# EAGLE design Display BBM (EAGLE 9.6.2)
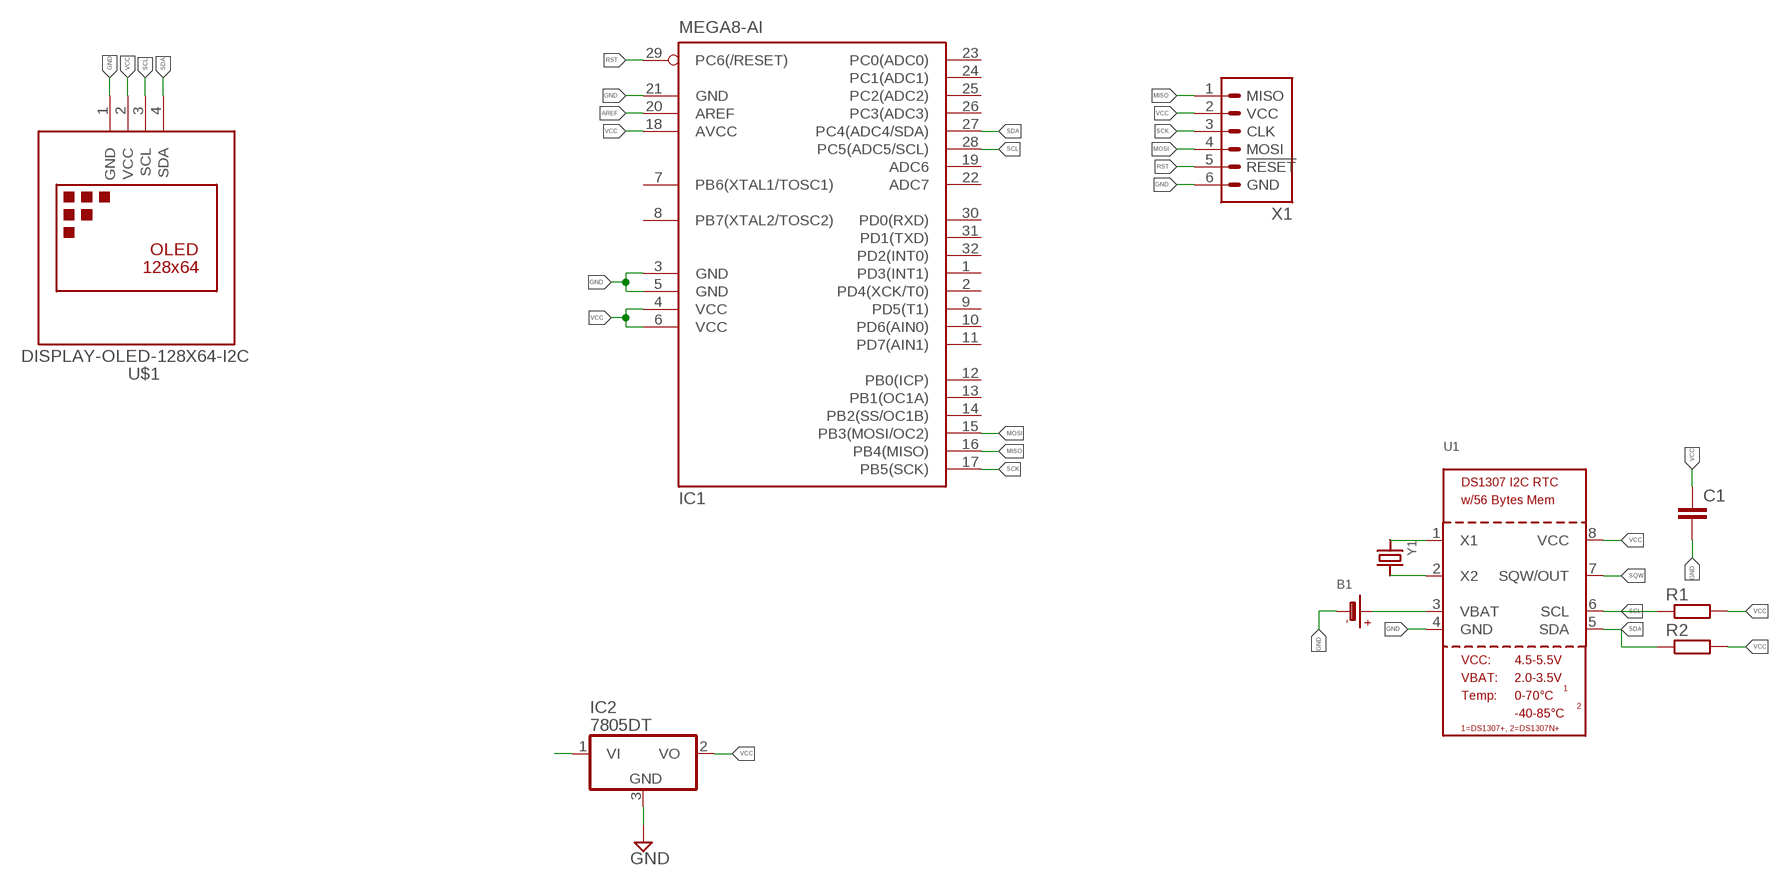
[diagram p0: schematic, sheet 1]

## Parts
B1  BATTERYCR1220_SMT  [CR1220]
C1  C-EUC0603K  [C0603K]
IC1  MEGA8-AI  [TQFP32-08]
IC2  7805DT  [TO252]
R1  R-EU_R0603  [R0603]
R2  R-EU_R0603  [R0603]
U1  RTC_DS1307  [SOIC8_150MIL]
U$1  DISPLAY-OLED-128X64-I2C  [DISPLAY-OLED-128X64-I2C]
X1  MISO_MOSIIDC-06V  [IDC-06V]
Y1  CRYSTAL8.0X3.8  [CRYSTAL_8X3.8]

## Nets
AREF: IC1.20(AREF)
GND: B1.- C1.2 IC1.3(GND) IC1.5(GND) IC1.21(GND) IC2.3(GND) U1.4(GND) U$1.1(GND) X1.6(GND)
MISO: IC1.16(PB4(MISO)) X1.1(MISO)
MOSI: IC1.15(PB3(MOSI/OC2)) X1.4(MOSI)
N$1: IC2.1(VI)
N$2: U1.1(X1) Y1.P$1
N$3: U1.2(X2) Y1.P$4
RST: IC1.29(PC6(/RESET)) X1.5(!RESET)
SCK: IC1.17(PB5(SCK)) X1.3(CLK)
SCL: IC1.28(PC5(ADC5/SCL)) R1.1 U1.6(SCL) U$1.3(SCL)
SDA: IC1.27(PC4(ADC4/SDA)) R2.1 U1.5(SDA) U$1.4(SDA)
SQW: U1.7(SQW/OUT)
VBATT: B1.+$1(+) U1.3(VBAT)
VCC: C1.1 IC1.4(VCC) IC1.6(VCC) IC1.18(AVCC) IC2.2(VO) R1.2 R2.2 U1.8(VCC) U$1.2(VCC) X1.2(VCC)
Unconnected: IC1.1(PD3(INT1)) IC1.2(PD4(XCK/T0)) IC1.7(PB6(XTAL1/TOSC1)) IC1.8(PB7(XTAL2/TOSC2)) IC1.9(PD5(T1)) IC1.10(PD6(AIN0)) IC1.11(PD7(AIN1)) IC1.12(PB0(ICP)) IC1.13(PB1(OC1A)) IC1.14(PB2(SS/OC1B)) IC1.19(ADC6) IC1.22(ADC7) IC1.23(PC0(ADC0)) IC1.24(PC1(ADC1)) IC1.25(PC2(ADC2)) IC1.26(PC3(ADC3)) IC1.30(PD0(RXD)) IC1.31(PD1(TXD)) IC1.32(PD2(INT0))

## Library data of the parts
B1 = RTC_Lib:BATTERY: CR1220 SMT - Digikey: 3001K-ND CD2032 BAT-HLD-001 - Digikey: BAT-HLD-001-ND
C1 = rcl:C-EU: CAPACITOR, European symbol; SPICEPREFIX: C
IC1 = atmel:MEGA8: MICROCONTROLLER 8 Kbytes FLASH, 1 kbytes SRAM, 512 bytes EEPROM, USART, 6-channel 10 bit ADC, 2-channel 8 bit ADC Pin compatible with Atmega48, ATMega88, ATMega168 Source: avr.lbr; MPN: ATMEGA8-16AU; OC_FARNELL: 9171371; OC_NEWARK: 73M8863
IC2 = linear:78*: Positive VOLTAGE REGULATOR Source: http://cache.national.com/ds/LM/LM78L05.pdf http://www.fairchildsemi.com/ds/LM/LM7805.pdf
R1 R2 = rcl:R-EU_: RESISTOR, European symbol; SPICEPREFIX: R
U1 = RTC_Lib:RTC_DS1307: DS1307 I2C RTC with 56-Bytes RAM
U$1 = diy-modules:DISPLAY-OLED-128X64-I2C: 128x64 Dot Matrix OLED Module based on SSD1306 chip Variant with I2C interface More details available here: http://www.instructables.com/id/Monochrome-096-i2c-OLED-display-with-arduino-SSD13/ SSD1306 datasheet: https://cdn-shop.adafruit.com/datasheets/SSD1306.pdf Click here to find device on ebay.com <http://www.ebay.com/sch/oled+display+128x64+iic> Note: There are two variants: I2C and SPI. Search for the proper version.
X1 = atmel:MISO_MOSI: MISO/MOSI Programmer Interface refere to Atmel/Microchip description of pin header style <http://microchipdeveloper.com/atmelice:connecting-atmel-ice-to-a-debugwire-target>
Y1 = RTC_Lib:CRYSTAL: Crystals HC49UP - Surface Mount Crystal 4.0MHz 18pF +/-30ppm Surface Mount Crystal [Digikey: 535-9857-1-ND] 12.0 MHz Surface Mount Crystal [Digikey: 535-9869-6-ND] 25.0 MHz Surface Mount Crystal [Digikey: 535-9078-1-ND] 2.5 x 2.0mm - MEMs SMT Crystal 16.0 MHz 10pF 20ppm 2.5 x 2.0mm Crystal [Digikey -40-85°C: 535-10923-1-ND] 3.2 x 2.5mm - MEMs SMT Crystal 12.0 MHz 8pF 15ppm 3.2 x 2.5mm Crystal [Digikey: -10-70°C: 644-1047-1-ND -40-125°C: 644-1128-1-ND] 40~85°C cheaper: 644-1173-6-ND 16.0 MHz 8pF 15ppm 3.2 x 2.5mm Crystal [Digikey: -10-70°C: 644-1049-1-ND -40-125°C: 644-1129-2-ND]-40~85°C cheaper: 644-1175-6-ND 16.0 MHz 10pF 10ppm 3.2 x 2.5mm Crystal [Digikey: 644-1100-1-ND] 27.12 MHz 18pF 30ppm 3.2 x 2.5mm Crystal [Digikey: 887-1424-1-ND] 27.12MHz 10pF 10ppm 3.2 x 2.5mm Crystal [Digikey: 887-1329-1-ND] 4.9 x 1.8mm - MEMs SMT Crystal 32.768 KHz 12.5pF 20ppm 4.9 x 1.8mm Crystal [Digikey: SE2415CT-ND] 8.0 x 3.8mm - Surface Mount Crystal 32.768kHz 12.5pF 20ppm -40°C-85°C [Digikey: 535-9166-2-ND] Cylinder 32.768KHz Cylinder Crystal (2x6mm body) [Ex. Digikey: 300-8341-2-ND]

## Board
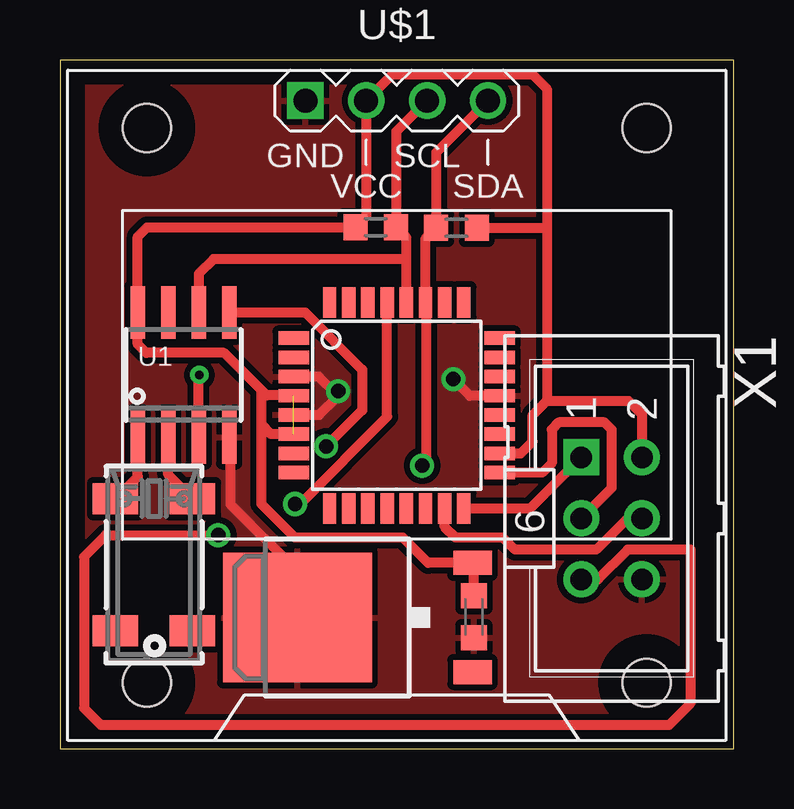
[diagram p1: board, top side]
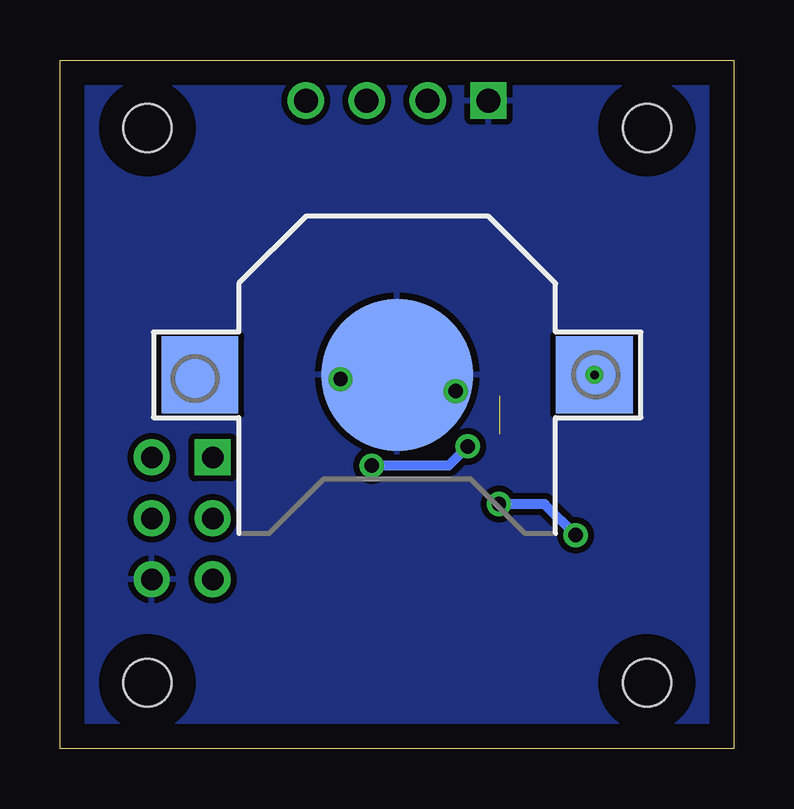
[diagram p2: board, bottom side, seen from below]

Size 28.1 x 28.7 mm. Coordinates in mm from the lower left corner, seen from the top.
Outline: 0,0 28.1,0 28.1,28.7 0,28.7 0,0
Copper layers (1*16): Top 0.035mm / dielectric 1.5mm / Bottom 0.035mm
Design rules "default": minimum track width 6mil, minimum drill 0.35mm, track to track 6mil, track to pad 6mil, pad to pad 6mil, via to via 6mil, smd to smd 6mil, copper to edge 40mil, drill to drill 6mil, minimum pad ring 10mil, minimum via ring 8mil, stop-mask expansion 4mil, vias tented up to drill 0mil, thermal gap 10mil

### Footprints (pad centres in the part's own frame; a part is rotated, then mirrored left to right if it is on the bottom)
CR1220 = smd 3.2 x 3.2: +$1 -8.225,0; +$2 8.225,0 | smd 6.35 x 6.35: - 0,0
C0603K = smd 1.05 x 1.08: 1 -0.875,0; 2 0.875,0
TQFP32-08 = smd 1.27 x 0.559: 1 -4.293,2.8; 2 -4.293,2; 3 -4.293,1.2; 4 -4.293,0.4; 5 -4.293,-0.4; 6 -4.293,-1.2; 7 -4.293,-2; 8 -4.293,-2.8; 17 4.293,-2.8; 18 4.293,-2; 19 4.293,-1.2; 20 4.293,-0.4; 21 4.293,0.4; 22 4.293,1.2; 23 4.293,2; 24 4.293,2.8 | smd 0.559 x 1.27: 9 -2.8,-4.293; 10 -2,-4.293; 11 -1.2,-4.293; 12 -0.4,-4.293; 13 0.4,-4.293; 14 1.2,-4.293; 15 2,-4.293; 16 2.8,-4.293; 25 2.8,4.293; 26 2,4.293; 27 1.2,4.293; 28 0.4,4.293; 29 -0.4,4.293; 30 -1.2,4.293; 31 -2,4.293; 32 -2.8,4.293
TO252 = smd 1 x 1.6: 1 -2.28,-4.8; 2 2.28,-4.8 | smd 5.4 x 6.2: 3 0,2.5
R0603 = smd 1 x 1.1: 1 -0.85,0; 2 0.85,0
SOIC8_150MIL = smd 0.6 x 2.2: 1 -1.905,-2.6; 2 -0.635,-2.6; 3 0.635,-2.6; 4 1.905,-2.6; 5 1.905,2.6; 6 0.635,2.6; 7 -0.635,2.6; 8 -1.905,2.6
DISPLAY-OLED-128X64-I2C = drill 1 square: 1 -3.81,12.7 | drill 1: 2 -1.27,12.7; 3 1.27,12.7; 4 3.81,12.7 | hole 2: -10.414,11.557; 10.414,11.557; 10.414,-11.557; -10.414,-11.557
IDC-06V = drill 0.9 pad 1.5 square: 1 -2.54,-1.27 | drill 0.9 pad 1.5: 2 -2.54,1.27; 3 0,-1.27; 4 0,1.27; 5 2.54,-1.27; 6 2.54,1.27
CRYSTAL_8X3.8 = smd 1.3 x 1.9: P$1 -2.75,-1.6; P$2 2.75,-1.6; P$3 2.75,1.6; P$4 -2.75,1.6

### Placement (x,y rotation side)
B1  14.04,15.58 180 bottom
C1  17.26,5.5 270 top
IC1  14.04,14.31 0 top
IC2  12.4,5.47 90 top
R1  13.17,21.73 180 top
R2  16.53,21.71 0 top
U1  5.15,15.58 0 top
U$1  14.04,14.31 0 top
X1  23,9.6 270 top
Y1  3.92,7.67 270 top

### Tracks (layer width: path | path; a pad name or v marks a point on that pad's centre or on a via)
GND  (via drill 0.6)
  Top 0.406: IC1.5 10.81,13.91 11.6,14.7 v11.6,14.9 11.5,14.8 10.79,15.51 IC1.3 | U1.4 7.1,12.93 7.1,10.2 9.9,7.4 IC2.3 | IC1.21 17.09,14.71 v16.4,15.4
  Bottom 0.406: B1.- 13.1,15.58 | 13.1,15.58 12.28,15.58 v11.6,14.9 | v16.4,15.4 13.28,15.4 13.1,15.58
  pour Top (isolate 0.254): 28.1,0 0,0 0,28.7 28.1,28.7
  pour Bottom (isolate 0.254): 0,28.7 0,0 28.1,0 28.1,28.7
MISO
  Top 0.406: IC1.16 19.61,10.02 X1.1
MOSI
  Top 0.406: X1.4 23.67,9.6 22.36,8.29 18.97,8.29 18.47,8.8 16.5,8.8 16.04,9.26 IC1.15
N$2
  Top 0.406: Y1.P$1 3.25,11.34 U1.1
N$3
  Top 0.406: Y1.P$4 4.51,11.43 U1.2
RST  (via drill 0.6)
  Top 0.406: IC1.29 13.64,13.84 10,10.2 v9.8,10.2 | v6.6,8.9 1.9,8.9 1,8 1,1.7 1.7,1 25.4,1 26.3,1.9 26.3,8.3 23.67,8.3 22.43,7.06 X1.5
  Bottom 0.406: v6.6,8.9 7.9,10.2 v9.8,10.2
SCK
  Top 0.406: X1.3 23,10.87 23,13.3 22.7,13.6 20.8,13.6 20.5,13.3 20.5,11.9 20.11,11.51 IC1.17
SCL
  Top 0.406: IC1.28 14.44,20.4 | 14.44,20.4 14.44,21.31 R1.1 14.02,25.72 U$1.3 | 14.44,20.4 6.4,20.4 5.79,19.79 U1.6
SDA  (via drill 0.6)
  Top 0.406: U$1.4 15.68,24.84 R2.1 15.24,21.27 IC1.27 15.3,18.54 15.25,18.49 15.25,11.95 v15.1,11.8 | U1.5 10.22,18.18 12.6,15.8 12.6,14.1 v11.1,12.6
  Bottom 0.406: v11.1,12.6 11.9,11.8 v15.1,11.8
VBATT  (via drill 0.35)
  Top 0.406: U1.3 5.79,15.55 B1.+$1
  other vias: 5.81,15.58
VCC  (1 unrouted)
  Top 0.406: IC1.4 9.73,14.73 8.62,14.73 8.37,14.98 | X1.2 24.27,13.93 23.7,14.5 20.3,14.5 | 20.3,14.5 19.7,13.9 19.7,12.8 19.21,12.31 IC1.18 | C1.1 17.26,7.69 IC2.2 15.35,7.75 14.3,8.8 9.8,8.8 8.4,10.2 8.4,13.5 | IC1.6 8.79,13.11 8.4,13.5 | 8.4,13.5 8.4,13.7 8.4,14.94 6.84,16.5 3.6,16.5 3.25,16.86 U1.8 3.25,21.35 3.63,21.73 R1.2 12.77,22.18 U$1.2 13.86,28.1 19.7,28.1 20.3,27.5 20.3,21.8 | 20.3,21.8 20.3,14.5 | R2.2 20.21,21.71 20.3,21.8